# Altium schematic sheet i2c_dev_blk.SchDoc
size A4; Engineer: JBayalas; DocumentNumber: 7; Revision: V1.0; SheetNumber: 7; SheetTotal: 11
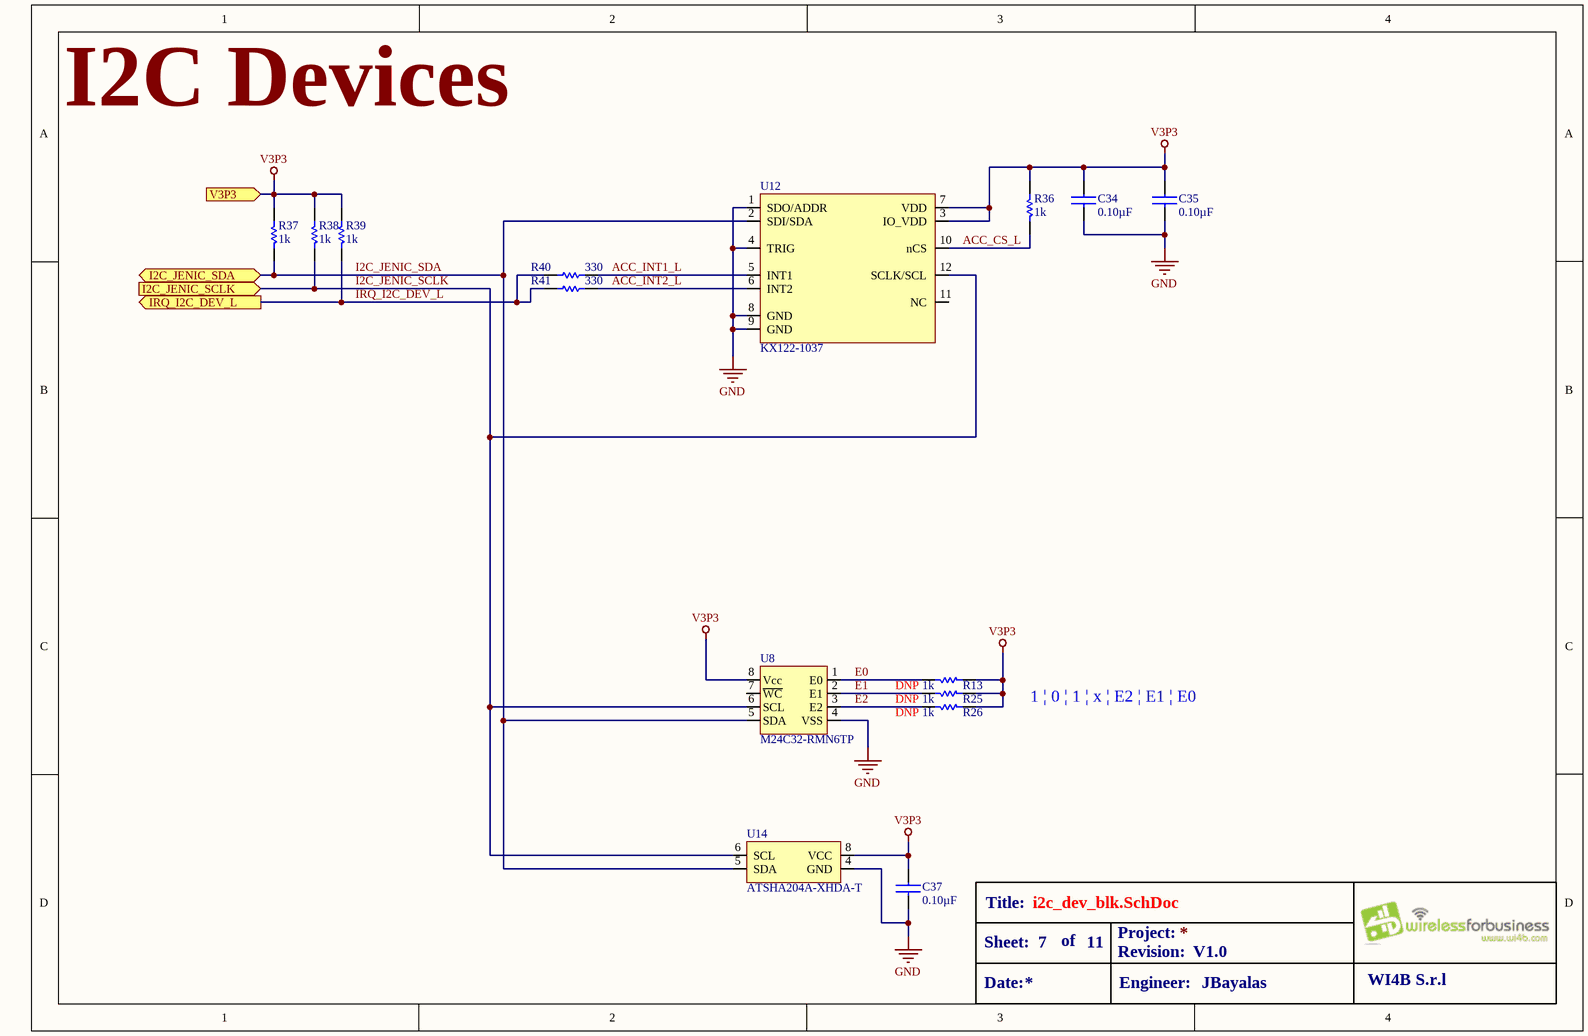
[diagram p0: i2c_dev_blk.SchDoc]

## Parts
C34  value 0.10µF  [C0402]  (hidden comment: GRM155R71H104ME14D)
C35  value 0.10µF  [C0402]  (hidden comment: GRM155R71H104ME14D)
C37  value 0.10µF  [C0402]  (hidden comment: GRM155R71H104ME14D)
R13  value 1k  [R0402]  (hidden comment: MCS04020C1001FE000)
R25  value 1k  [R0402]  (hidden comment: MCS04020C1001FE000)
R26  value 1k  [R0402]  (hidden comment: MCS04020C1001FE000)
R36  value 1k  [R0402]  (hidden comment: MCS04020C1001FE000)
R37  value 1k  [R0402]  (hidden comment: MCS04020C1001FE000)
R38  value 1k  [R0402]  (hidden comment: MCS04020C1001FE000)
R39  value 1k  [R0402]  (hidden comment: MCS04020C1001FE000)
R40  value 330  [R0402]  (hidden comment: CRCW0402330RFKED)
R41  value 330  [R0402]  (hidden comment: CRCW0402330RFKED)
U8  M24C32-RMN6TP  [8-SOIC]
U12  KX122-1037  [KX122-1037]
U14  ATSHA204A-XHDA-T  [TSSOP-8 (wide Body)]

## Ports
I2C_JENIC_SCLK (in), I2C_JENIC_SDA (bidir), IRQ_I2C_DEV_L (out), V3P3 (in)

## Nets
GND: C34.2 C35.2 C37.2 U8.4(VSS) U12.1(SDO/ADDR) U12.4(TRIG) U12.8(GND) U12.9(GND) U14.4(GND)
V3P3: C34.1 C35.1 C37.1 R13.1 R25.1 R26.1 R36.2 R37.2 R38.2 R39.2 U8.8(Vcc) U12.3(IO_VDD) U12.7(VDD) U14.8(VCC) ; port V3P3
ACC_CS_L: R36.1 U12.10(nCS)
ACC_INT1_L: R40.1 U12.5(INT1)
ACC_INT2_L: R41.1 U12.6(INT2)
E0: R13.2 U8.1(E0)
E1: R25.2 U8.2(E1)
E2: R26.2 U8.3(E2)
I2C_JENIC_SCLK: R38.1 U8.6(SCL) U12.12(SCLK/SCL) U14.6(SCL) ; port I2C_JENIC_SCLK
I2C_JENIC_SDA: R37.1 U8.5(SDA) U12.2(SDI/SDA) U14.5(SDA) ; port I2C_JENIC_SDA
IRQ_I2C_DEV_L: R39.1 R40.2 R41.2 ; port IRQ_I2C_DEV_L

Not connected (* = marked no-connect by the designer): U8 7(~{WC}); U12 11(NC)

## Notes on the sheet
- I2C Devices
- 1 | 0 | 1 | x | E2 | E1 | E0
- Title:
- Sheet:
- Date:
- of
- Project:
- Revision:
- Engineer:
- WI4B S.r.l

## Library data of the parts
C34 C35 C37 = GRM155R71H104ME14D: CAP CER 0.1UF 50V X7R 0402; MFT: Murata Electronics North America; TYPE: SMD; MPN: GRM155R71H104ME14D; RATING: 50V; DNP: *
R13 R25 R26 R36-R39 = MCS04020C1001FE000: RES SMD 1K OHM 1% 1/10W 0402; MFT: Vishay Beyschlag; MPN: MCS04020C1001FE000; TYPE: SMD; RATING: 1/10W
  R13 R25 R26: DNP: DNP
  R36-R39: DNP: *
R40 R41 = CRCW0402330RFKED: RES SMD 330 OHM 1% 1/16W 0402; MFT: Vishay Dale; MPN: CRCW0402330RFKED; TYPE: SMD; RATING: 1/16W; DNP: *
U8 = M24C32-RMN6TP: IC EEPROM 32KBIT 400KHZ 8SO; MFT: STMicroelectronics; VALUE: M24C32-RMN6TP; RATING: *; TYPE: SMD; LOAD: *; MPN: M24C32-RMN6TP
U12 = KX122-1037: ACCELEROMETER 2-8G I2C/SPI 12LGA; MFT: Kionix Inc.; LOAD: *; RATING: *; TYPE: SMD; VALUE: KX122-1037; MPN: KX122-1037
U14 = ATSHA204A-XHDA-T: IC CRYPTO 4.5KB I2C; MFT: Microchip Technology; LOAD: *; TYPE: SMD; RATING: *; VALUE: ATSHA204A-XHDA-T; MPN: ATSHA204A-XHDA-T